# Altium project BOOST.PrjPcb
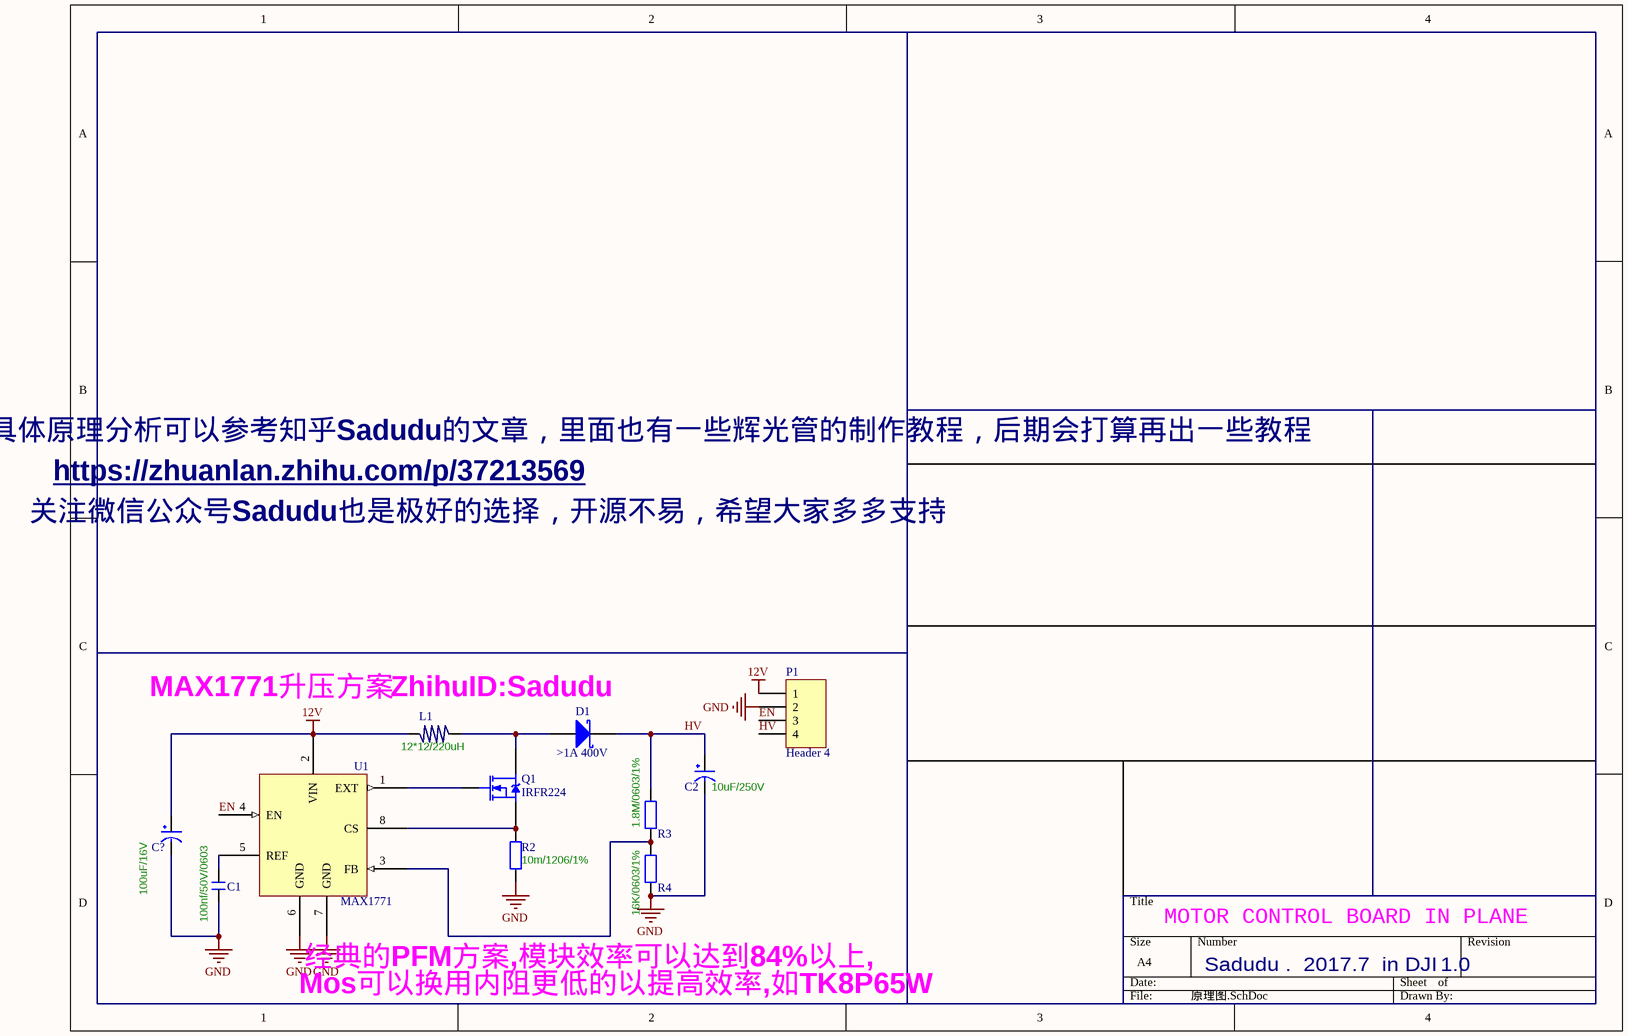
[diagram p0: 原理图.SchDoc]
1 sheet, 11 parts. Net scope: global (net labels, ports and power ports of the same name join across sheets).
Board files: BOOST.PcbDoc, SaduduLogo.PcbDoc, 小猪佩琪和蛇.PcbDoc

## Sheet 原理图.SchDoc
size A4

### Parts
C1  100nf/50V/0603  [C-RAD-0805]
C2  10uF/250V  [5032]
C?  100uF/16V  [5032]
D1  Type: >1A 400V  [DIODE-SMA]  (hidden comment: D-Schottky)
L1  12*12/220uH  [l1212]
P1  Header 4  [HDR1X4_BLUE]
Q1  IRFR224  [D-PAK]
R2  value 10m/1206/1%  [1206]  (hidden comment: Res1)
R3  value 1.8M/0603/1%  [0805-1]  (hidden comment: Res1)
R4  value 16K/0603/1%  [0805-1]  (hidden comment: Res1)
U1  MAX1771  [sop-8]

### Nets
12V: C?.1(VCC) L1.1 P1.1 U1.2(VIN)
GND: C1.2 C2.2(GND) C?.2(GND) P1.2 R2.1 R4.2 U1.6(GND) U1.7(GND)
EN: P1.3 U1.4(EN)
HV: C2.1(VCC) D1.2(K) P1.4 R3.1
NetC1_1: C1.1 U1.5(REF)
NetD1_1: D1.1(A) L1.2 Q1.D
NetQ1_G: Q1.G U1.1(EXT)
NetQ1_S: Q1.S R2.2 U1.8(CS)
NetR3_2: R3.2 R4.1 U1.3(FB)

### Notes on the sheet
- 具体原理分析可以参考知乎Sadudu的文章，里面也有一些辉光管的制作教程，后期会打算再出一些教程
- https://zhuanlan.zhihu.com/p/37213569
- 关注微信公众号Sadudu也是极好的选择，开源不易，希望大家多多支持
- MAX1771升压方案
- ZhihuID:Sadudu
- MOTOR CONTROL BOARD IN PLANE
- 经典的PFM方案,模块效率可以达到84%以上,
- Mos可以换用内阻更低的以提高效率,如TK8P65W
- Sadudu .  2017.7  in DJI
- 1.0

### Library data of the parts
C1 = C_1
C2 C? = CAP
D1 = D-Schottky: 肖特基二极管; Published: 8-Jun-2000; LatestRevisionDate: 17-Jul-2002; LatestRevisionNote: Re-released for DXP Platform.; PackageReference: SMB; Publisher: Altium Limited; Code_JEDEC: DO-214-AA
L1 = L
P1 = Header 4: Header, 4-Pin; LatestRevisionDate: 17-Jul-2002; LatestRevisionNote: Re-released for DXP Platform.; Publisher: Altium Limited
Q1 = MOSFET-N: N-Channel MOSFET; pin to pad: D>2 G>1 S>3; PackageDocument: 1995/1996; Published: 8-Jun-2000; LatestRevisionDate: 17-Jul-2002; LatestRevisionNote: Re-released for DXP Platform.; PackageReference: E3; Publisher: Altium Limited
R2-R4 = Res1: 贴片电阻; Published: 8-Jun-2000; LatestRevisionDate: 17-Jul-2002; LatestRevisionNote: Re-released for DXP Platform.; PackageReference: AXIAL-0.4; Publisher: Altium Limited